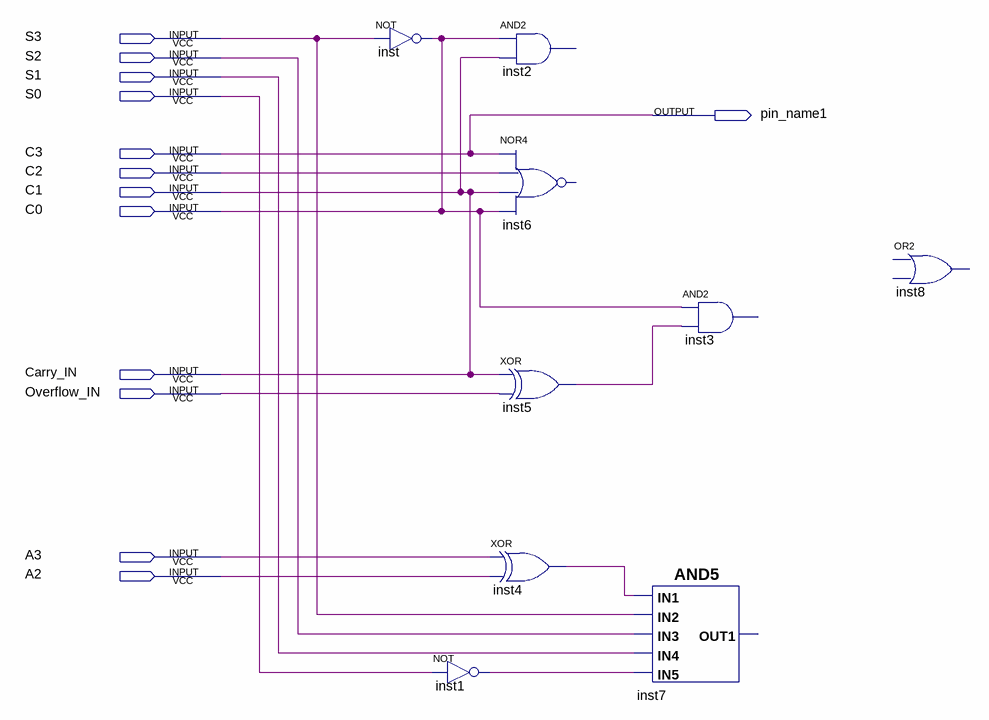
[diagram p0: schematic sheet]
// Quartus schematic state4bits.bdf as structural Verilog: 9 symbols, 13 pins
module state4bits (
  input  S3,
  input  S2,
  input  S1,
  input  S0,
  input  C3,
  input  C2,
  input  C1,
  input  C0,
  input  Carry_IN,
  input  Overflow_IN,
  input  A3,
  input  A2,
  output pin_name1
);

  wire inst1_out, inst4_out, inst5_out;

  not inst (C0, S3);
  not inst1 (inst1_out, S0);
  // AND2 inst2 has open pins: IN1=C0, IN2=C1, OUT=open
  // NOR4 inst6 has open pins: IN1=C3, IN2=C2, IN3=C1, IN4=C0, OUT=open
  xor inst5 (inst5_out, C1, Overflow_IN);
  xor inst4 (inst4_out, A3, A2);
  // AND2 inst3 has open pins: IN1=C0, IN2=inst5_out, OUT=open
  AND5 inst7 (.IN3(S2), .IN2(S3), .IN1(inst4_out), .IN5(inst1_out), .IN4(S1));  // open: OUT1
  // OR2 inst8 is placed but not wired

  assign Carry_IN = C1;
  assign pin_name1 = C3;
endmodule
